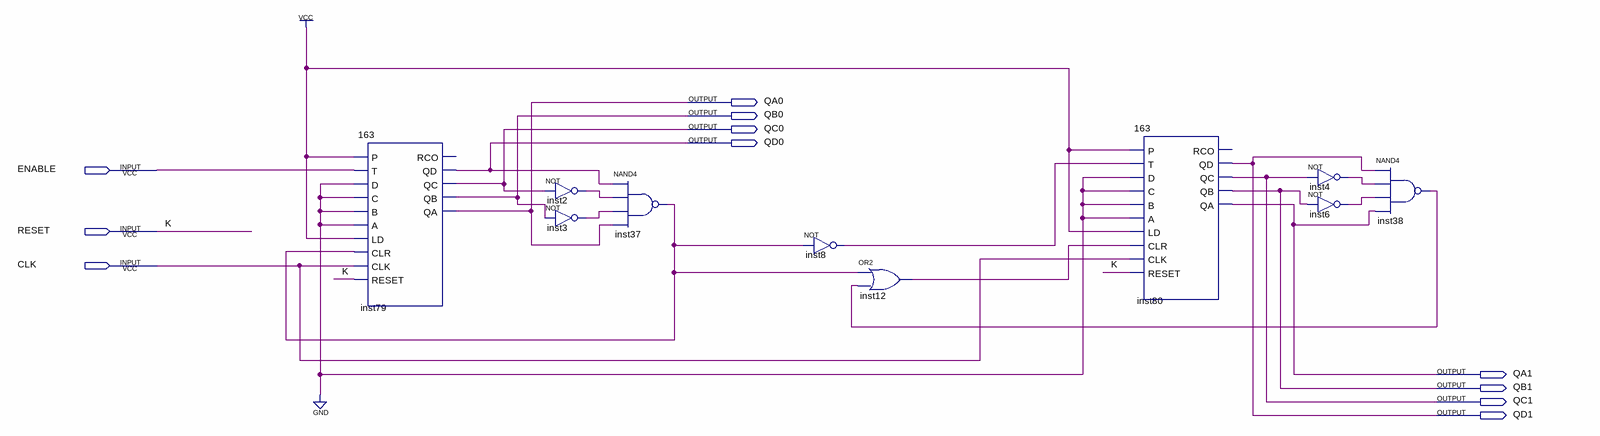
[diagram p0: schematic sheet]
// Quartus schematic TC.bdf as structural Verilog: 10 symbols, 11 pins
module TC (
  input  ENABLE,
  input  RESET,
  input  CLK,
  output QA0,
  output QB0,
  output QC0,
  output QD0,
  output QA1,
  output QB1,
  output QC1,
  output QD1
);

  wire inst2_out, inst3_out, inst4_out, inst6_out, inst8_out, inst12_out, inst37_out, inst38_out;

  \163  inst79 (
    .P(1'b1), .T(ENABLE), .D(1'b0), .C(1'b0), .B(1'b0), .A(1'b0), .LD(1'b1), .CLR(inst37_out), .CLK(CLK),
    .RESET(RESET), .QD(QD0), .QC(QC0), .QB(QB0), .QA(QA0));  // open: RCO
  not inst2 (inst2_out, QC0);
  not inst3 (inst3_out, QB0);
  nand inst37 (inst37_out, QD0, inst2_out, inst3_out, QA0);
  not inst8 (inst8_out, inst37_out);
  or inst12 (inst12_out, inst37_out, inst38_out);
  \163  inst80 (
    .P(1'b1), .T(inst8_out), .D(1'b0), .C(1'b0), .B(1'b0), .A(1'b0), .LD(1'b1), .CLR(inst12_out), .CLK(CLK),
    .RESET(RESET), .QD(QD1), .QC(QC1), .QB(QB1), .QA(QA1));  // open: RCO
  not inst4 (inst4_out, QC1);
  not inst6 (inst6_out, QB1);
  nand inst38 (inst38_out, QD1, inst4_out, inst6_out, QA1);

  // Other names for the same wires on the sheet: K = RESET
endmodule
